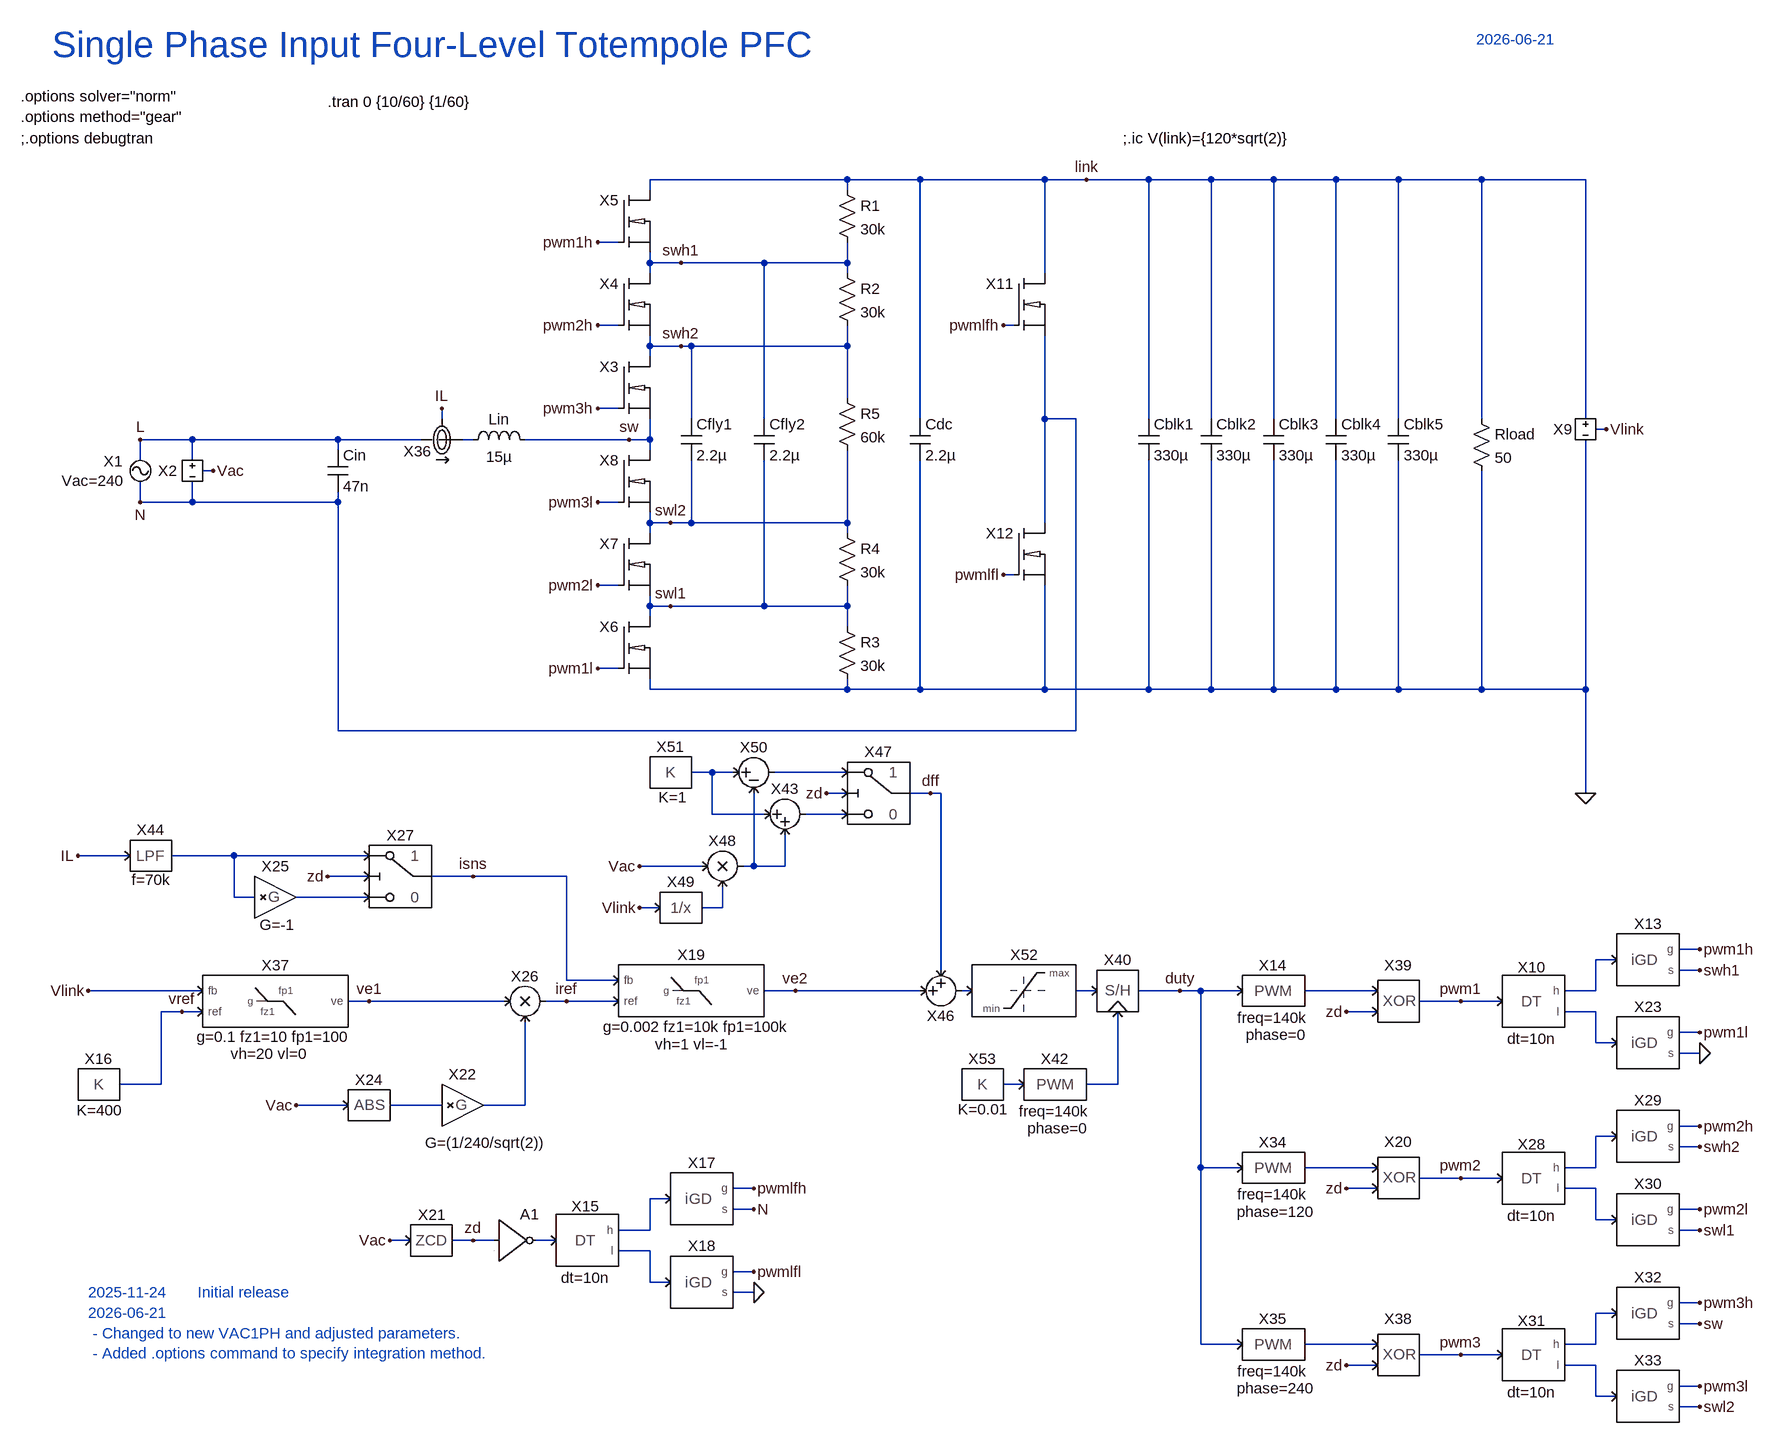
[diagram p0: schematic 1Ph-4LvTTP-PFC.asc]
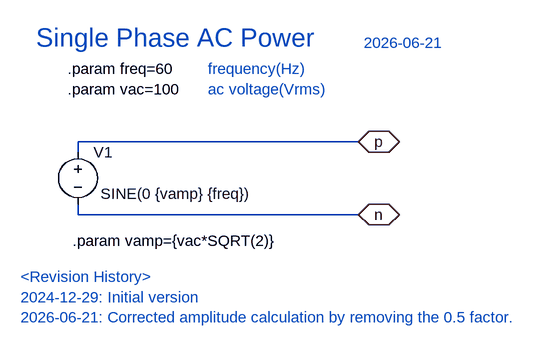
[diagram p1: sub-circuit vac1ph.asc]
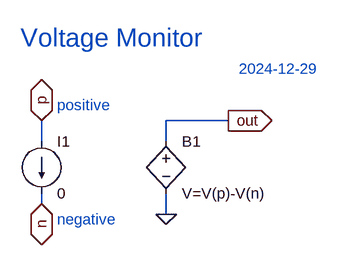
[diagram p2: sub-circuit vmon.asc]
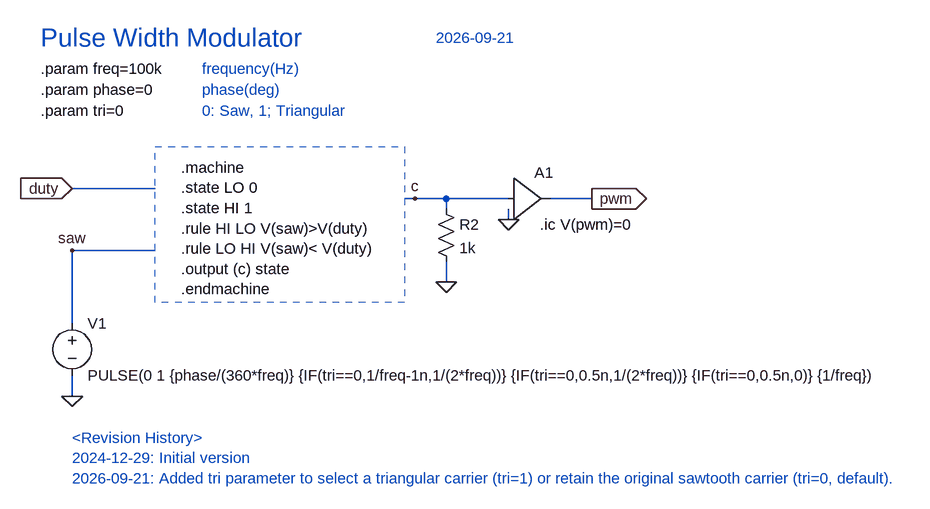
[diagram p3: sub-circuit pwm.asc]
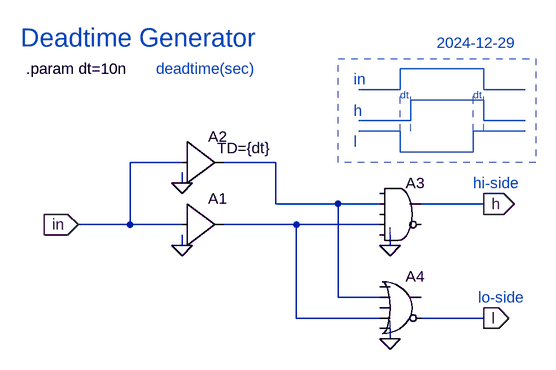
[diagram p4: sub-circuit deadtime.asc]
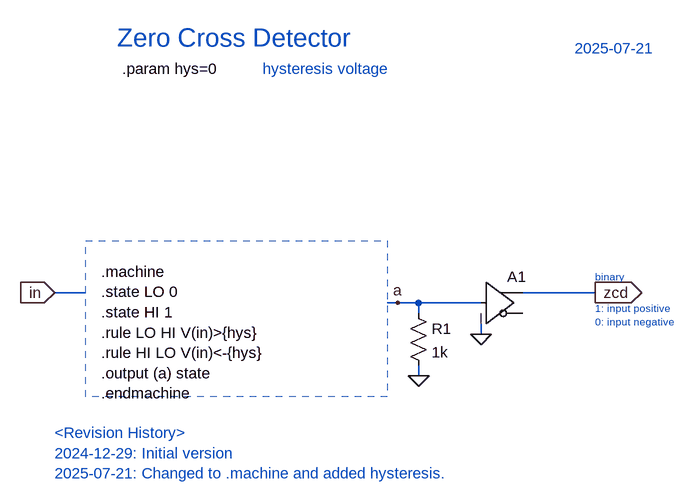
[diagram p5: sub-circuit zcd.asc]
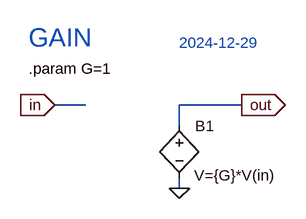
[diagram p6: sub-circuit gain.asc]
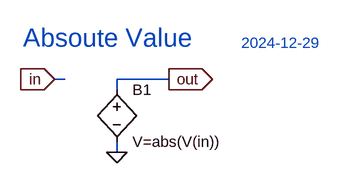
[diagram p7: sub-circuit abs.asc]
1Ph-4LvTTP-PFC.asc, the LTspice schematic file:
Version 4.1
SHEET 1 2440 2172
WIRE 800 -128 496 -128
WIRE 912 -128 800 -128
WIRE 1104 -128 912 -128
WIRE 1168 -128 1104 -128
WIRE 1264 -128 1168 -128
WIRE 1360 -128 1264 -128
WIRE 1456 -128 1360 -128
WIRE 1552 -128 1456 -128
WIRE 1648 -128 1552 -128
WIRE 1776 -128 1648 -128
WIRE 1936 -128 1776 -128
WIRE 496 -112 496 -128
WIRE 800 -112 800 -128
WIRE 448 -32 416 -32
WIRE 496 0 496 -16
WIRE 544 0 496 0
WIRE 672 0 544 0
WIRE 800 0 800 -32
WIRE 800 0 672 0
WIRE 496 16 496 0
WIRE 800 16 800 0
WIRE 1104 16 1104 -128
WIRE 448 96 416 96
WIRE 1056 96 1040 96
WIRE 496 128 496 112
WIRE 544 128 496 128
WIRE 560 128 544 128
WIRE 800 128 800 96
WIRE 800 128 560 128
WIRE 496 144 496 128
WIRE 800 208 800 128
WIRE 448 224 416 224
WIRE 176 240 176 224
WIRE 560 240 560 128
WIRE 672 240 672 0
WIRE 912 240 912 -128
WIRE 1104 240 1104 112
WIRE 1152 240 1104 240
WIRE 1264 240 1264 -128
WIRE 1360 240 1360 -128
WIRE 1456 240 1456 -128
WIRE 1552 240 1552 -128
WIRE 1648 240 1648 -128
WIRE 1776 240 1776 -128
WIRE 1936 240 1936 -128
WIRE 1968 256 1952 256
WIRE -208 272 -288 272
WIRE 16 272 -208 272
WIRE 144 272 16 272
WIRE 224 272 208 272
WIRE 464 272 304 272
WIRE 496 272 496 240
WIRE 496 272 464 272
WIRE 16 288 16 272
WIRE 496 288 496 272
WIRE -288 304 -288 272
WIRE -208 304 -208 272
WIRE -176 320 -192 320
WIRE -288 368 -288 336
WIRE -208 368 -208 336
WIRE -208 368 -288 368
WIRE 16 368 16 352
WIRE 16 368 -208 368
WIRE 448 368 416 368
WIRE 496 400 496 384
WIRE 528 400 496 400
WIRE 560 400 560 304
WIRE 560 400 528 400
WIRE 800 400 800 288
WIRE 800 400 560 400
WIRE 1104 400 1104 240
WIRE 496 416 496 400
WIRE 800 416 800 400
WIRE 1056 480 1040 480
WIRE 448 496 416 496
WIRE 496 528 496 512
WIRE 528 528 496 528
WIRE 672 528 672 304
WIRE 672 528 528 528
WIRE 800 528 800 496
WIRE 800 528 672 528
WIRE 496 544 496 528
WIRE 800 560 800 528
WIRE 448 624 416 624
WIRE 496 656 496 640
WIRE 800 656 800 640
WIRE 800 656 496 656
WIRE 912 656 912 304
WIRE 912 656 800 656
WIRE 1104 656 1104 496
WIRE 1104 656 912 656
WIRE 1264 656 1264 304
WIRE 1264 656 1104 656
WIRE 1360 656 1360 304
WIRE 1360 656 1264 656
WIRE 1456 656 1456 304
WIRE 1456 656 1360 656
WIRE 1552 656 1552 304
WIRE 1552 656 1456 656
WIRE 1648 656 1648 304
WIRE 1648 656 1552 656
WIRE 1776 656 1776 320
WIRE 1776 656 1648 656
WIRE 1936 656 1936 272
WIRE 1936 656 1776 656
WIRE 16 720 16 368
WIRE 1152 720 1152 240
WIRE 1152 720 16 720
WIRE 592 784 560 784
WIRE 624 784 592 784
WIRE 800 784 688 784
WIRE 800 816 768 816
WIRE 928 816 896 816
WIRE 944 816 928 816
WIRE 1936 816 1936 656
WIRE 592 848 592 784
WIRE 672 848 592 848
WIRE 800 848 736 848
WIRE -304 912 -384 912
WIRE -144 912 -240 912
WIRE 64 912 -144 912
WIRE 576 928 480 928
WIRE 656 928 656 816
WIRE 656 928 640 928
WIRE 704 928 704 880
WIRE 704 928 656 928
WIRE 64 944 0 944
WIRE 224 944 160 944
WIRE 368 944 224 944
WIRE -144 976 -144 912
WIRE -112 976 -144 976
WIRE 64 976 -48 976
WIRE 512 992 480 992
WIRE 608 992 608 960
WIRE 608 992 576 992
WIRE 2112 1056 2080 1056
WIRE 1984 1072 1952 1072
WIRE 944 1088 944 816
WIRE 2112 1088 2080 1088
WIRE 368 1104 368 944
WIRE 448 1104 368 1104
WIRE -192 1120 -368 1120
WIRE 720 1120 672 1120
WIRE 912 1120 720 1120
WIRE 992 1120 976 1120
WIRE 1184 1120 1152 1120
WIRE 1312 1120 1248 1120
WIRE 1344 1120 1312 1120
WIRE 1408 1120 1344 1120
WIRE 1616 1120 1504 1120
WIRE 1952 1120 1952 1072
WIRE 1952 1120 1904 1120
WIRE 64 1136 32 1136
WIRE 272 1136 64 1136
WIRE 368 1136 336 1136
WIRE 448 1136 368 1136
WIRE 1744 1136 1680 1136
WIRE 1808 1136 1744 1136
WIRE -224 1152 -256 1152
WIRE -192 1152 -224 1152
WIRE 1616 1152 1568 1152
WIRE 1952 1152 1904 1152
WIRE 2112 1184 2080 1184
WIRE 1952 1200 1952 1152
WIRE 1984 1200 1952 1200
WIRE 2112 1216 2080 1216
WIRE -256 1264 -256 1152
WIRE -256 1264 -320 1264
WIRE 1072 1264 1040 1264
WIRE 1216 1264 1216 1152
WIRE 1216 1264 1168 1264
WIRE 32 1296 -48 1296
WIRE 176 1296 96 1296
WIRE 304 1296 304 1168
WIRE 304 1296 240 1296
WIRE 2112 1328 2080 1328
WIRE 1984 1344 1952 1344
WIRE 2112 1360 2080 1360
WIRE 1344 1392 1344 1120
WIRE 1408 1392 1344 1392
WIRE 1616 1392 1504 1392
WIRE 1952 1392 1952 1344
WIRE 1952 1392 1904 1392
WIRE 1744 1408 1680 1408
WIRE 1808 1408 1744 1408
WIRE 656 1424 624 1424
WIRE 1616 1424 1568 1424
WIRE 1952 1424 1904 1424
WIRE 528 1440 496 1440
WIRE 656 1456 624 1456
WIRE 2112 1456 2080 1456
WIRE 1952 1472 1952 1424
WIRE 1984 1472 1952 1472
WIRE 496 1488 496 1440
WIRE 496 1488 448 1488
WIRE 2112 1488 2080 1488
WIRE 128 1504 96 1504
WIRE 224 1504 192 1504
WIRE 256 1504 224 1504
WIRE 352 1504 320 1504
WIRE 496 1520 448 1520
WIRE 656 1552 624 1552
WIRE 496 1568 496 1520
WIRE 528 1568 496 1568
WIRE 656 1584 624 1584
WIRE 2112 1600 2080 1600
WIRE 1984 1616 1952 1616
WIRE 2112 1632 2080 1632
WIRE 1344 1664 1344 1392
WIRE 1408 1664 1344 1664
WIRE 1616 1664 1504 1664
WIRE 1952 1664 1952 1616
WIRE 1952 1664 1904 1664
WIRE 1744 1680 1680 1680
WIRE 1808 1680 1744 1680
WIRE 1616 1696 1568 1696
WIRE 1952 1696 1904 1696
WIRE 2112 1728 2080 1728
WIRE 1952 1744 1952 1696
WIRE 1984 1744 1952 1744
WIRE 2112 1760 2080 1760
FLAG -176 320 Vac
FLAG 416 -32 pwm1h
FLAG 416 96 pwm2h
FLAG 416 224 pwm3h
FLAG 416 368 pwm3l
FLAG 416 496 pwm2l
FLAG 416 624 pwm1l
FLAG -288 272 L
FLAG -288 368 N
FLAG 176 224 IL
FLAG 1168 -128 link
FLAG 1936 816 0
FLAG 1968 256 Vlink
FLAG -368 1120 Vlink
FLAG -48 1296 Vac
FLAG -384 912 IL
FLAG 656 1424 pwmlfh
FLAG 656 1456 N
FLAG 656 1552 pwmlfl
FLAG 96 1504 Vac
FLAG 368 1136 iref
FLAG 224 944 isns
FLAG 1312 1120 duty
FLAG 224 1504 zd
FLAG 0 944 zd
FLAG 656 1584 0
FLAG 2112 1056 pwm1h
FLAG 2112 1088 swh1
FLAG 2112 1184 pwm1l
FLAG 2112 1216 0
FLAG 2112 1328 pwm2h
FLAG 2112 1360 swh2
FLAG 2112 1456 pwm2l
FLAG 2112 1488 swl1
FLAG 2112 1600 pwm3h
FLAG 2112 1632 sw
FLAG 2112 1728 pwm3l
FLAG 2112 1760 swl2
FLAG 544 0 swh1
FLAG 544 128 swh2
FLAG 528 400 swl2
FLAG 528 528 swl1
FLAG 464 272 sw
FLAG 1568 1152 zd
FLAG 1568 1424 zd
FLAG 1568 1696 zd
FLAG -224 1152 vref
FLAG 1744 1136 pwm1
FLAG 1744 1408 pwm2
FLAG 1744 1680 pwm3
FLAG 928 816 dff
FLAG 480 928 Vac
FLAG 480 992 Vlink
FLAG 1040 96 pwmlfh
FLAG 1040 480 pwmlfl
FLAG 768 816 zd
FLAG 64 1136 ve1
FLAG 720 1120 ve2
SYMBOL VAC1ph -288 320 R0
WINDOW 39 -25 15 Right 2
WINDOW 0 -27 -15 Right 2
SYMATTR SpiceLine Vac=240
SYMATTR InstName X1
SYMBOL VMON -208 320 R0
WINDOW 0 -23 0 Right 2
SYMATTR InstName X2
SYMBOL ind 208 288 R270
WINDOW 0 32 56 VTop 2
WINDOW 3 5 56 VBottom 2
SYMATTR InstName Lin
SYMATTR Value 15µ
SYMATTR SpiceLine Rser=1m
SYMBOL iNMOS 496 192 R0
SYMATTR InstName X3
SYMBOL cap 544 240 R0
SYMATTR InstName Cfly1
SYMATTR Value 2.2µ
SYMATTR SpiceLine Rser=1m
SYMBOL iNMOS 496 64 R0
SYMATTR InstName X4
SYMBOL iNMOS 496 -64 R0
SYMATTR InstName X5
SYMBOL cap 656 240 R0
SYMATTR InstName Cfly2
SYMATTR Value 2.2µ
SYMATTR SpiceLine Rser=1m
SYMBOL iNMOS 496 592 R0
SYMATTR InstName X6
SYMBOL iNMOS 496 464 R0
SYMATTR InstName X7
SYMBOL iNMOS 496 336 R0
SYMATTR InstName X8
SYMBOL cap 896 240 R0
SYMATTR InstName Cdc
SYMATTR Value 2.2µ
SYMATTR SpiceLine Rser=1m
SYMBOL res 1760 224 R0
SYMATTR InstName Rload
SYMATTR Value 50
SYMBOL cap 0 288 R0
SYMATTR InstName Cin
SYMATTR Value 47n
SYMATTR SpiceLine Rser=1m
SYMBOL VMON 1936 256 R0
SYMATTR InstName X9
SYMBOL PWM 1456 1120 R0
WINDOW 39 -56 41 Left 2
WINDOW 0 -1 -55 Top 2
WINDOW 40 4 52 Top 2
SYMATTR SpiceLine freq=140k
SYMATTR InstName X14
SYMBOL DEADTIME 400 1504 R0
WINDOW 0 -3 -68 Top 2
WINDOW 39 -3 42 Top 2
SYMATTR InstName X15
SYMBOL CONST -352 1264 R0
WINDOW 39 1 55 Bottom 2
SYMATTR SpiceLine K=400
SYMATTR InstName X16
SYMBOL iGD 576 1440 R0
SYMATTR InstName X17
SYMBOL iGD 576 1568 R0
SYMATTR InstName X18
SYMBOL ZCD 160 1504 R0
WINDOW 0 1 -24 Bottom 2
SYMATTR InstName X21
SYMBOL GAIN 208 1296 R0
WINDOW 39 36 73 Bottom 2
SYMATTR SpiceLine G=(1/240/sqrt(2))
SYMATTR InstName X22
SYMBOL ABS 64 1296 R0
SYMATTR InstName X24
SYMBOL GAIN -80 976 R0
WINDOW 39 3 58 Bottom 2
SYMATTR SpiceLine G=-1
SYMATTR InstName X25
SYMBOL MUL 304 1136 R0
SYMATTR InstName X26
SYMBOL MUX 112 944 R0
SYMATTR InstName X27
SYMBOL Digital\\inv 256 1440 R0
SYMATTR InstName A1
SYMBOL DEADTIME 1856 1136 R0
WINDOW 0 -3 -68 Top 2
WINDOW 39 -3 42 Top 2
SYMATTR InstName X10
SYMBOL iGD 2032 1072 R0
SYMATTR InstName X13
SYMBOL iGD 2032 1200 R0
SYMATTR InstName X23
SYMBOL DEADTIME 1856 1408 R0
WINDOW 0 -3 -68 Top 2
WINDOW 39 -3 42 Top 2
SYMATTR InstName X28
SYMBOL iGD 2032 1344 R0
SYMATTR InstName X29
SYMBOL iGD 2032 1472 R0
SYMATTR InstName X30
SYMBOL DEADTIME 1856 1680 R0
WINDOW 0 -3 -68 Top 2
WINDOW 39 -3 42 Top 2
SYMATTR InstName X31
SYMBOL iGD 2032 1616 R0
SYMATTR InstName X32
SYMBOL iGD 2032 1744 R0
SYMATTR InstName X33
SYMBOL PWM 1456 1392 R0
WINDOW 39 -56 41 Left 2
WINDOW 0 -1 -55 Top 2
WINDOW 40 4 52 Top 2
SYMATTR SpiceLine freq=140k
SYMATTR InstName X34
SYMATTR SpiceLine2 phase=120
SYMBOL PWM 1456 1664 R0
WINDOW 39 -56 41 Left 2
WINDOW 0 -1 -55 Top 2
WINDOW 40 4 52 Top 2
SYMATTR SpiceLine freq=140k
SYMATTR InstName X35
SYMATTR SpiceLine2 phase=240
SYMBOL IMON 176 272 M180
SYMATTR InstName X36
SYMBOL TYPE2_gm -80 1136 R0
WINDOW 39 -3 70 Bottom 2
WINDOW 40 -10 96 Bottom 2
SYMATTR SpiceLine g=0.1 fz1=10 fp1=100
SYMATTR SpiceLine2 vh=20 vl=0
SYMATTR InstName X37
SYMBOL TYPE2_gm 560 1120 R0
WINDOW 39 8 71 Bottom 2
WINDOW 40 1 98 Bottom 2
WINDOW 123 4 -101 Bottom 2
SYMATTR SpiceLine g=0.002 fz1=10k fp1=100k
SYMATTR SpiceLine2 vh=1 vl=-1
SYMATTR InstName X19
SYMBOL EXOR 1648 1136 R0
WINDOW 0 0 -40 Bottom 2
SYMATTR InstName X39
SYMBOL EXOR 1648 1408 R0
WINDOW 0 0 -40 Bottom 2
SYMATTR InstName X20
SYMBOL EXOR 1648 1680 R0
WINDOW 0 0 -40 Bottom 2
SYMATTR InstName X38
SYMBOL cap 1248 240 R0
SYMATTR Value 330µ
SYMATTR InstName Cblk1
SYMATTR SpiceLine V=450 Irms=1.45 Rser=0.104 Lser=24.231n mfg="W・th Elektronik" pn="861141486022 WCAP-AI3H 35x40" type="Al electrolytic"
SYMBOL cap 1344 240 R0
SYMATTR Value 330µ
SYMATTR InstName Cblk2
SYMATTR SpiceLine V=450 Irms=1.45 Rser=0.104 Lser=24.231n mfg="W・th Elektronik" pn="861141486022 WCAP-AI3H 35x40" type="Al electrolytic"
SYMBOL cap 1440 240 R0
SYMATTR Value 330µ
SYMATTR InstName Cblk3
SYMATTR SpiceLine V=450 Irms=1.45 Rser=0.104 Lser=24.231n mfg="W・th Elektronik" pn="861141486022 WCAP-AI3H 35x40" type="Al electrolytic"
SYMBOL cap 1536 240 R0
SYMATTR Value 330µ
SYMATTR InstName Cblk4
SYMATTR SpiceLine V=450 Irms=1.45 Rser=0.104 Lser=24.231n mfg="W・th Elektronik" pn="861141486022 WCAP-AI3H 35x40" type="Al electrolytic"
SYMBOL cap 1632 240 R0
SYMATTR Value 330µ
SYMATTR InstName Cblk5
SYMATTR SpiceLine V=450 Irms=1.45 Rser=0.104 Lser=24.231n mfg="W・th Elektronik" pn="861141486022 WCAP-AI3H 35x40" type="Al electrolytic"
SYMBOL PWM 1120 1264 R0
WINDOW 39 -56 41 Left 2
WINDOW 0 -1 -55 Top 2
WINDOW 40 4 52 Top 2
SYMATTR SpiceLine freq=140k
SYMATTR InstName X42
SYMBOL LPF -272 912 R0
WINDOW 3 1 53 Bottom 2
SYMATTR Value f=70k
SYMATTR InstName X44
SYMBOL SAMPLEHOLD 1216 1120 R0
SYMATTR InstName X40
SYMBOL SUM 944 1120 M180
SYMATTR InstName X46
SYMBOL MUX 848 816 R0
SYMATTR InstName X47
SYMBOL MUL 608 928 R0
SYMATTR InstName X48
SYMBOL INVERSE 544 992 R0
SYMATTR InstName X49
SYMBOL SUB 656 784 R0
SYMATTR InstName X50
SYMBOL CONST 528 784 R0
WINDOW 39 3 54 Bottom 2
SYMATTR InstName X51
SYMBOL LIMIT 1072 1120 R0
SYMATTR InstName X52
SYMBOL iNMOS 1104 64 R0
SYMATTR InstName X11
SYMBOL iNMOS 1104 448 R0
SYMATTR InstName X12
SYMBOL CONST 1008 1264 R0
WINDOW 39 1 54 Bottom 2
SYMATTR SpiceLine K=0.01
SYMATTR InstName X53
SYMBOL res 784 -128 R0
SYMATTR InstName R1
SYMATTR Value 30k
SYMBOL res 784 0 R0
SYMATTR InstName R2
SYMATTR Value 30k
SYMBOL res 784 544 R0
SYMATTR InstName R3
SYMATTR Value 30k
SYMBOL res 784 400 R0
SYMATTR InstName R4
SYMATTR Value 30k
SYMBOL res 784 192 R0
SYMATTR InstName R5
SYMATTR Value 60k
SYMBOL SUM 704 848 R0
SYMATTR InstName X43
TEXT -424 -336 Left 5 ;Single Phase Input Four-Level Totempole PFC
TEXT 1768 -344 Left 2 ;2026-06-21
TEXT 0 -248 Left 2 !.tran 0 {10/60} {1/60}
TEXT -472 -256 Left 2 !.options solver="norm"\n.options method="gear"
TEXT -472 -192 Left 2 !;.options debugtran
TEXT 1224 -192 Left 2 !;.ic V(link)={120*sqrt(2)}
TEXT -368 1584 Left 2 ;2025-11-24       Initial release\n2026-06-21       \n - Changed to new VAC1PH and adjusted parameters.\n - Added .options command to specify integration method.

vac1ph.asc, the sub-circuit schematic file:
Version 4.1
SHEET 1 1308 680
WIRE 496 112 64 112
WIRE 64 128 64 112
WIRE 64 224 64 208
WIRE 496 224 64 224
FLAG 496 112 p
IOPIN 496 112 BiDir
FLAG 496 224 n
IOPIN 496 224 BiDir
SYMBOL voltage 64 112 R0
WINDOW 3 35 80 Left 2
WINDOW 123 0 0 Left 0
WINDOW 39 0 0 Left 0
SYMATTR Value SINE(0 {vamp} {freq})
SYMATTR InstName V1
TEXT 48 0 Left 2 !.param freq=60\n.param vac=100
TEXT 0 -48 Left 4 ;Single Phase AC Power
TEXT 264 0 Left 2 ;frequency(Hz)\nac voltage(Vrms)
TEXT 56 264 Left 2 !.param vamp={vac*SQRT(2)}
TEXT 504 -40 Left 2 ;2026-06-21
TEXT -24 320 Left 2 ;<Revision History>\n2024-12-29: Initial version\n2026-06-21: Corrected amplitude calculation by removing the 0.5 factor.

vmon.asc, the sub-circuit schematic file:
Version 4
SHEET 1 880 680
WIRE 176 -32 80 -32
WIRE -112 0 -112 -32
WIRE 80 0 80 -32
WIRE -112 96 -112 80
WIRE 80 112 80 80
FLAG -112 -32 p
IOPIN -112 -32 BiDir
FLAG -112 96 n
IOPIN -112 96 BiDir
FLAG 176 -32 out
IOPIN 176 -32 Out
FLAG 80 112 0
SYMBOL bv 80 -16 R0
SYMATTR InstName B1
SYMATTR Value V=V(p)-V(n)
SYMBOL current -112 0 R0
WINDOW 123 0 0 Left 0
WINDOW 39 0 0 Left 0
SYMATTR InstName I1
SYMATTR Value 0
TEXT -144 -160 Left 4 ;Voltage Monitor
TEXT -88 -56 Left 2 ;positive
TEXT -88 120 Left 2 ;negative
TEXT 192 -112 Left 2 ;2024-12-29

pwm.asc, the sub-circuit schematic file:
Version 4.1
SHEET 1 1668 1312
WIRE 32 64 -96 64
WIRE 432 80 416 80
WIRE 480 80 432 80
WIRE 576 80 480 80
WIRE 704 80 640 80
WIRE 480 96 480 80
WIRE 576 112 576 96
WIRE 32 160 -96 160
WIRE 480 208 480 176
WIRE -96 272 -96 160
WIRE -96 384 -96 352
FLAG -96 64 duty
IOPIN -96 64 In
FLAG 704 80 pwm
IOPIN 704 80 Out
FLAG 480 208 0
FLAG 432 80 c
FLAG 576 112 0
FLAG -96 384 0
FLAG -96 160 saw
SYMBOL res 464 80 R0
SYMATTR InstName R2
SYMATTR Value 1k
SYMBOL Digital\\buf1 576 16 R0
SYMATTR InstName A1
SYMBOL voltage -96 256 R0
WINDOW 123 0 0 Left 0
WINDOW 39 0 0 Left 0
SYMATTR InstName V1
SYMATTR Value PULSE(0 1 {phase/(360*freq)} {IF(tri==0,1/freq-1n,1/(2*freq))} {IF(tri==0,0.5n,1/(2*freq))} {IF(tri==0,0.5n,0)} {1/freq})
TEXT 72 32 Left 2 !.machine\n.state LO 0\n.state HI 1\n.rule HI LO V(saw)>V(duty)\n.rule LO HI V(saw)< V(duty)\n.output (c) state\n.endmachine
TEXT -144 -120 Left 2 !.param freq=100k
TEXT 624 120 Left 2 !.ic V(pwm)=0
TEXT -144 -88 Left 2 !.param phase=0
TEXT -144 -168 Left 4 ;Pulse Width Modulator
TEXT 464 -168 Left 2 ;2026-09-21
TEXT 104 -120 Left 2 ;frequency(Hz)
TEXT -144 -56 Left 2 !.param tri=0
TEXT 104 -56 Left 2 ;0: Saw, 1; Triangular
TEXT 104 -88 Left 2 ;phase(deg)
TEXT -96 448 Left 2 ;<Revision History>\n2024-12-29: Initial version\n2026-09-21: Added tri parameter to select a triangular carrier (tri=1) or retain the original sawtooth carrier (tri=0, default).
RECTANGLE Normal 416 240 32 0 2

deadtime.asc, the sub-circuit schematic file:
Version 4
SHEET 1 1412 1312
WIRE 64 288 -16 288
WIRE 208 288 128 288
WIRE 64 320 64 304
WIRE 208 352 208 288
WIRE 304 352 208 352
WIRE 368 352 304 352
WIRE 528 352 432 352
WIRE -16 384 -16 288
WIRE -16 384 -96 384
WIRE 64 384 -16 384
WIRE 240 384 128 384
WIRE 368 384 240 384
WIRE 64 416 64 400
WIRE 384 416 384 400
WIRE 304 496 304 352
WIRE 368 496 304 496
WIRE 240 528 240 384
WIRE 368 528 240 528
WIRE 528 528 432 528
WIRE 384 560 384 544
FLAG -96 384 in
IOPIN -96 384 In
FLAG 64 416 0
FLAG 64 320 0
FLAG 384 416 0
FLAG 384 560 0
FLAG 528 352 h
IOPIN 528 352 Out
FLAG 528 528 l
IOPIN 528 528 Out
SYMBOL Digital\\buf1 64 320 R0
SYMATTR InstName A1
SYMBOL Digital\\buf1 64 224 R0
WINDOW 3 54 42 Left 2
SYMATTR Value TD={dt}
SYMATTR InstName A2
SYMBOL Digital\\and 400 304 R0
SYMATTR InstName A3
SYMBOL Digital\\or 400 448 R0
SYMATTR InstName A4
TEXT -176 144 Left 2 !.param dt=10n
TEXT -184 96 Left 4 ;Deadtime Generator
TEXT 24 144 Left 2 ;deadtime(sec)
TEXT 512 320 Left 2 ;hi-side
TEXT 520 496 Left 2 ;lo-side
TEXT 328 160 Left 2 ;in
TEXT 328 208 Left 2 ;h
TEXT 328 256 Left 2 ;l
TEXT 400 184 Left 1 ;dt
TEXT 512 184 Left 1 ;dt
TEXT 456 104 Left 2 ;2024-12-29
LINE Normal 400 176 336 176
LINE Normal 400 176 400 144
LINE Normal 528 144 400 144
LINE Normal 528 176 528 144
LINE Normal 592 176 528 176
LINE Normal 416 224 336 224
LINE Normal 416 224 416 192
LINE Normal 528 192 416 192
LINE Normal 528 224 528 192
LINE Normal 592 224 528 224
LINE Normal 400 240 336 240
LINE Normal 400 272 400 240
LINE Normal 512 272 400 272
LINE Normal 512 272 512 240
LINE Normal 592 240 512 240
LINE Normal 400 240 400 176 2
LINE Normal 512 240 512 176 2
LINE Normal 416 240 416 176 2
LINE Normal 528 240 528 176 2
RECTANGLE Normal 608 288 304 128 2

zcd.asc, the sub-circuit schematic file:
Version 4.1
SHEET 1 952 680
WIRE -32 384 -80 384
WIRE 752 384 640 384
WIRE 448 400 432 400
WIRE 480 400 448 400
WIRE 576 400 480 400
WIRE 480 416 480 400
WIRE 576 448 576 432
WIRE 480 512 480 496
FLAG -80 384 in
IOPIN -80 384 In
FLAG 752 384 zcd
IOPIN 752 384 Out
FLAG 480 512 0
FLAG 448 400 a
FLAG 576 448 0
SYMBOL res 464 400 R0
SYMATTR InstName R1
SYMATTR Value 1k
SYMBOL Digital\\buf 576 336 R0
SYMATTR InstName A1
TEXT 16 -8 Left 4 ;Zero Cross Detector
TEXT 752 360 Left 1 ;binary
TEXT 752 408 Left 1 ;1: input positive\n0: input negative
TEXT 720 8 Left 2 ;2025-07-21
TEXT -8 352 Left 2 !.machine\n.state LO 0\n.state HI 1\n.rule LO HI V(in)>{hys}\n.rule HI LO V(in)<-{hys}\n.output (a) state\n.endmachine
TEXT 24 40 Left 2 !.param hys=0
TEXT 240 40 Left 2 ;hysteresis voltage
TEXT -80 600 Left 2 ;<Revision History>\n2024-12-29: Initial version\n2025-07-21: Changed to .machine and added hysteresis.
RECTANGLE Normal 432 544 -32 304 2

gain.asc, the sub-circuit schematic file:
Version 4
SHEET 1 880 680
WIRE 0 64 -48 64
WIRE 240 64 144 64
WIRE 144 96 144 64
WIRE 144 192 144 176
FLAG 144 192 0
FLAG 240 64 out
IOPIN 240 64 Out
FLAG -48 64 in
IOPIN -48 64 In
SYMBOL bv 144 80 R0
WINDOW 3 23 92 Left 2
SYMATTR Value V={G}*V(in)
SYMATTR InstName B1
TEXT -88 8 Left 2 !.param G=1
TEXT -88 -40 Left 4 ;GAIN
TEXT 144 -32 Left 2 ;2024-12-29

abs.asc, the sub-circuit schematic file:
Version 4
SHEET 1 880 680
WIRE 80 128 64 128
WIRE 240 128 160 128
WIRE 160 144 160 128
WIRE 160 240 160 224
FLAG 64 128 in
IOPIN 64 128 In
FLAG 160 240 0
FLAG 240 128 out
IOPIN 240 128 Out
SYMBOL bv 160 128 R0
SYMATTR InstName B1
SYMATTR Value V=abs(V(in))
TEXT 16 64 Left 4 ;Absoute Value
TEXT 352 72 Left 2 ;2024-12-29

mul.asc, the sub-circuit schematic file:
Version 4
SHEET 1 880 680
WIRE 96 48 48 48
WIRE 320 48 240 48
WIRE 96 64 96 48
WIRE 240 64 240 48
WIRE 96 160 96 144
WIRE 240 160 240 144
WIRE 96 208 48 208
WIRE 96 224 96 208
WIRE 96 320 96 304
FLAG 48 48 IN1
IOPIN 48 48 In
FLAG 48 208 IN2
IOPIN 48 208 In
FLAG 240 160 0
FLAG 320 48 OUT
IOPIN 320 48 Out
FLAG 96 160 0
FLAG 96 320 0
SYMBOL bv 240 48 R0
SYMATTR InstName B1
SYMATTR Value V=V(IN1)*V(IN2)
SYMBOL res 80 48 R0
SYMATTR InstName R1
SYMATTR Value 1Meg
SYMBOL res 80 208 R0
SYMATTR InstName R2
SYMATTR Value 1Meg
TEXT -16 -56 Left 4 ;Multiplier

mux.asc, the sub-circuit schematic file:
Version 4
SHEET 1 880 680
WIRE 336 16 208 16
WIRE 128 32 96 32
WIRE 208 48 208 16
WIRE 128 80 96 80
WIRE 128 144 96 144
WIRE 208 160 208 128
FLAG 96 32 in1
IOPIN 96 32 In
FLAG 96 80 in2
IOPIN 96 80 In
FLAG 96 144 sel
IOPIN 96 144 In
FLAG 336 16 out
IOPIN 336 16 Out
FLAG 208 160 0
SYMBOL bv 208 32 R0
SYMATTR InstName B1
SYMATTR Value V=IF(V(sel)>0.5,V(in1),V(in2))
TEXT 24 -40 Left 2 ;2-1 Multiplexer
TEXT 40 120 Left 1 ;binary
TEXT 40 168 Left 1 ;1: out=in1\n0: out=in2

type2_gm.asc, the sub-circuit schematic file:
Version 4.1
SHEET 1 1136 680
WIRE 432 -144 432 -160
WIRE 544 -144 544 -160
WIRE 432 -48 432 -64
WIRE 544 -48 544 -64
WIRE -128 144 -128 112
WIRE 416 144 416 96
WIRE -336 176 -368 176
WIRE -336 256 -368 256
WIRE -128 272 -128 224
WIRE -128 272 -240 272
WIRE 0 272 -128 272
WIRE 416 272 416 208
WIRE 416 272 0 272
WIRE 640 272 416 272
WIRE -128 304 -128 272
WIRE -240 336 -240 272
WIRE 0 336 0 272
WIRE 416 352 416 272
WIRE -128 416 -128 384
WIRE 416 448 416 416
WIRE -240 496 -240 416
WIRE -128 496 -128 480
WIRE 0 496 0 400
FLAG 640 272 ve
IOPIN 640 272 Out
FLAG -128 496 0
FLAG -240 496 0
FLAG 0 496 0
FLAG -128 112 0
FLAG 544 -48 0
FLAG 432 -48 0
FLAG 432 -160 +V
FLAG 544 -160 -V
FLAG 416 448 -V
FLAG 416 96 +V
FLAG -368 176 fb
IOPIN -368 176 In
FLAG -368 256 ref
IOPIN -368 256 In
SYMBOL bi -128 144 R0
SYMATTR InstName B1
SYMATTR Value I=(limit(V(ref)-V(fb),{-Ilim},{Ilim}))
SYMBOL res -144 288 R0
SYMATTR InstName R1
SYMATTR Value {Rz1}
SYMBOL cap -144 416 R0
SYMATTR InstName C1
SYMATTR Value {Cz1}
SYMBOL res -256 320 R0
SYMATTR InstName R2
SYMATTR Value {avol}
SYMBOL cap -16 336 R0
SYMATTR InstName C2
SYMATTR Value {Co1}
SYMBOL diode 432 416 R180
WINDOW 0 24 64 Left 2
WINDOW 3 24 0 Left 2
SYMATTR InstName D1
SYMATTR Value myD
SYMBOL voltage 432 -160 R0
SYMATTR InstName V1
SYMATTR Value {vh}
SYMBOL voltage 544 -160 R0
WINDOW 123 0 0 Left 0
WINDOW 39 24 44 Left 2
SYMATTR InstName V2
SYMATTR Value {vl}
SYMBOL diode 432 208 R180
WINDOW 0 24 64 Left 2
WINDOW 3 24 0 Left 2
SYMATTR InstName D2
SYMATTR Value myD
TEXT -336 -224 Left 2 !.param g=1\n.param fz1=1k\n.param fp1=20k\n.param vh=5\n.param vl=0\n.param avol=100k
TEXT -352 -288 Left 4 ;Type 2 Compensator, Gm amp base
TEXT -104 -224 Left 2 ;target gain at fz1\nzero frequency(Hz)\npole frequency(Hz)\nmax ouput voltage(V)\nmin output voltage(V)\nopen loop gain
TEXT 808 -328 Left 2 ;2025-08-31
TEXT -56 24 Left 2 !.param Rz1={(g*avol)/(avol-g)}\n.param Cz1={1/(2*PI*fz1*Rz1)}\n.param Co1={1/(2*PI*fp1*Rz1)}
TEXT 488 312 Left 2 !.ic V(ve)=0
TEXT 480 440 Left 2 !.MODEL myD D(RON=1u ROFF=1G Vfwd=10n)
TEXT -88 184 Left 2 !.param Ilim=1000
TEXT 672 -184 Left 2 ;<Revision History>\n2025-08-31: Initial version
TEXT -416 144 Left 2 ;feedback
TEXT -416 216 Left 2 ;reference
TEXT 384 -288 Left 1 ;* TYPE2_gm is a Gm-amp based version of TYPE2.\n* Unlike the op-amp based TYPE2, it offers high input impedance at ref/fb\n* and is better suited for dynamic reference applications (e.g. soft-start,\n* motor speed control). Both models are kept for flexibility.
RECTANGLE Normal 992 -208 368 -304 2

exor.asc, the sub-circuit schematic file:
Version 4
SHEET 1 880 680
WIRE 160 128 32 128
WIRE 368 128 224 128
WIRE 160 160 32 160
WIRE 192 192 192 176
FLAG 192 192 0
FLAG 32 128 in1
IOPIN 32 128 In
FLAG 32 160 in2
IOPIN 32 160 In
FLAG 368 128 out
IOPIN 368 128 Out
SYMBOL Digital\\xor 208 80 R0
WINDOW 0 -28 14 Left 2
SYMATTR InstName A1
TEXT -24 104 Left 1 ;binary
TEXT -24 184 Left 1 ;binary
TEXT 368 104 Left 1 ;binary
TEXT -32 40 Left 4 ;Exclusive OR
TEXT 280 48 Left 2 ;2024-12-29

lpf.asc, the sub-circuit schematic file:
Version 4.1
SHEET 1 1652 804
WIRE 944 -80 848 -80
WIRE 192 -48 80 -48
WIRE 304 -48 272 -48
WIRE 384 -48 304 -48
WIRE 688 -48 464 -48
WIRE 80 -32 80 -48
WIRE 304 -32 304 -48
WIRE 464 -32 464 -48
WIRE 848 -16 848 -80
WIRE -96 0 -160 0
WIRE 304 48 304 32
WIRE 464 64 464 48
WIRE 80 80 80 48
WIRE 848 112 848 64
WIRE 192 288 192 256
WIRE 192 288 128 288
WIRE 256 288 192 288
WIRE 496 288 496 256
WIRE 496 288 432 288
WIRE 560 288 496 288
WIRE 192 320 192 288
WIRE 256 320 256 288
WIRE 432 320 432 288
WIRE 496 320 496 288
WIRE 560 320 560 288
WIRE 128 336 128 288
WIRE 128 480 128 416
WIRE 192 480 192 384
WIRE 256 480 256 400
WIRE 432 480 432 400
WIRE 496 480 496 384
WIRE 560 480 560 400
FLAG -160 0 in
IOPIN -160 0 In
FLAG 944 -80 out
IOPIN 944 -80 Out
FLAG 304 48 0
FLAG 80 80 0
FLAG 384 -48 a
FLAG 464 64 0
FLAG 848 112 0
FLAG 256 480 0
FLAG 192 256 v1
FLAG 496 256 v2
FLAG 128 480 0
FLAG 560 480 0
FLAG 688 -48 v0
FLAG 192 480 0
FLAG 496 480 0
FLAG 432 480 0
SYMBOL res 288 -64 R90
WINDOW 0 0 56 VBottom 2
WINDOW 3 32 56 VTop 2
SYMATTR InstName R1
SYMATTR Value 1k
SYMBOL cap 288 -32 R0
SYMATTR InstName C1
SYMATTR Value {Co}
SYMBOL bv 80 -48 R0
SYMATTR InstName B1
SYMATTR Value V=V(in)
SYMBOL bv 464 -48 R0
SYMATTR InstName B2
SYMATTR Value V=V(a)
SYMBOL bv 848 -32 R0
SYMATTR InstName B3
SYMATTR Value V=IF({n}==1,V(v0),V(v1))
SYMBOL res 240 304 R0
SYMATTR InstName R2
SYMATTR Value 1Gig
SYMBOL cap 176 320 R0
SYMATTR InstName C2
SYMATTR Value 1
SYMBOL bi 128 416 R180
WINDOW 0 24 80 Left 2
WINDOW 3 24 0 Left 2
SYMATTR InstName B5
SYMATTR Value I=V(v2)
SYMBOL res 448 304 M0
SYMATTR InstName R3
SYMATTR Value 1Gig
SYMBOL cap 512 320 M0
SYMATTR InstName C3
SYMATTR Value 1
SYMBOL bi 560 400 R180
WINDOW 3 -848 -5 Left 2
WINDOW 0 -56 82 Left 2
SYMATTR Value I={-(2*pi*f)*(2*pi*f)*V(v1)-(2*pi*f/q)*V(v2)+(2*pi*f)*(2*pi*f)*V(in)}
SYMATTR InstName B4
TEXT -264 -368 Left 4 ;1st/2nd order Low Pass Filter
TEXT 696 -368 Left 2 ;2025-12-26
TEXT -256 -304 Left 2 !.param f=100k\n.param n=1\n.param q=0.5
TEXT 328 -80 Left 2 !.param Co=1/({f}*2k*PI)
TEXT 0 -304 Left 2 ;cut off frequency\nfilter order (1:1st order, other: 2nd order)\nq factor (only for 2nd order)
TEXT -8 -112 Left 2 ;1st Order LPF
TEXT 8 160 Left 2 ;2nd Order LPF
TEXT -152 560 Left 2 ;<Revision History>\n2025-03-23: Initial version\n2025-12-26: \n -  Replaced LTspice built in 2ndOrderLPF with discrete circuit to improve convergence.\n -  Removed output MUX and replaced it with BV.
RECTANGLE Normal 752 112 -16 -96 2
RECTANGLE Normal 1440 512 -16 192 2

samplehold.asc, the sub-circuit schematic file:
Version 4
SHEET 1 880 680
WIRE 576 -560 480 -560
WIRE -80 -512 -128 -512
WIRE 480 -512 480 -560
WIRE 368 -496 368 -528
WIRE -80 -448 -128 -448
WIRE 368 -400 368 -416
WIRE 480 -400 480 -432
FLAG -128 -512 IN
IOPIN -128 -512 In
FLAG -128 -448 CLK
IOPIN -128 -448 In
FLAG 576 -560 OUT
IOPIN 576 -560 Out
FLAG 368 -400 0
FLAG 368 -528 o
FLAG 480 -400 0
SYMBOL res 352 -512 R0
SYMATTR InstName R1
SYMATTR Value 1k
SYMBOL bv 480 -528 R0
SYMATTR InstName B1
SYMATTR Value V=V(o)
TEXT -248 -672 Left 3 ;Sample & Hold
TEXT -248 -448 Left 1 ;binary
TEXT 496 -656 Left 2 ;2025-3-23
TEXT -24 -544 Left 2 !.machine\n.state LO 0\n.state LATCH 1\n.state HI 2\n.rule LO LATCH V(clk)>.5\n.rule LATCH HI  V(clk)>.9\n.rule * LO V(clk)<.5\n.output (o) IF((state==1),V(in),V(out))  \n.endmachine

sum.asc, the sub-circuit schematic file:
Version 4
SHEET 1 880 680
WIRE 288 96 208 96
WIRE 208 112 208 96
WIRE 96 128 48 128
WIRE 96 176 48 176
WIRE 208 208 208 192
FLAG 48 128 IN1
IOPIN 48 128 In
FLAG 48 176 IN2
IOPIN 48 176 In
FLAG 208 208 0
FLAG 288 96 OUT
IOPIN 288 96 Out
SYMBOL bv 208 96 R0
SYMATTR InstName B1
SYMATTR Value V=V(IN1)+V(IN2)
TEXT -16 32 Left 4 ;SUM
TEXT 200 40 Left 2 ;2024-12-29

inverse.asc, the sub-circuit schematic file:
Version 4
SHEET 1 1360 680
WIRE 672 144 192 144
WIRE 1264 144 672 144
WIRE 672 160 672 144
WIRE 192 176 192 144
WIRE 80 208 32 208
WIRE 672 240 672 224
WIRE 192 288 192 256
FLAG 32 208 in
IOPIN 32 208 In
FLAG 192 288 0
FLAG 1264 144 out
IOPIN 1264 144 Out
FLAG 672 240 0
SYMBOL bv 192 160 R0
WINDOW 3 37 125 Left 2
SYMATTR Value V=IF(V(in)>0,IF(V(in)>(1/{vsat}),1/V(in),{vsat}),IF(V(in)>(-1/{vsat}),-{vsat},1/V(in)))
SYMATTR InstName B1
SYMBOL cap 656 160 R0
SYMATTR InstName C1
SYMATTR Value 10p
SYMATTR SpiceLine Rser=1k
TEXT -32 16 Left 4 ;Inverse
TEXT 1168 8 Left 2 ;2025-2-23
TEXT -24 64 Left 2 !.param vsat=1k
TEXT 224 64 Left 2 ;saturation voltage
TEXT 120 400 Left 2 ;<Revision History>\n2025-01-03: Initial Versoin.\n2025-02-23: Added RC snubber(10pF-1kohm) at output to reduce spike

sub.asc, the sub-circuit schematic file:
Version 4
SHEET 1 880 680
WIRE 288 96 208 96
WIRE 208 112 208 96
WIRE 96 128 48 128
WIRE 96 176 48 176
WIRE 208 208 208 192
FLAG 48 128 IN1
IOPIN 48 128 In
FLAG 48 176 IN2
IOPIN 48 176 In
FLAG 208 208 0
FLAG 288 96 OUT
IOPIN 288 96 Out
SYMBOL bv 208 96 R0
SYMATTR InstName B1
SYMATTR Value V=V(IN1)-V(IN2)
TEXT -16 40 Left 2 ;SUBTRACT
TEXT 224 48 Left 2 ;2024-12-29

The netlist it stands for:
* 1Ph-4LvTTP-PFC.asc
X§X1 N L vac1ph params: Vac=240 freq=60
X§X2 N Vac L vmon
Lin N001 sw 15µ Rser=1m
X§X3 swh2 pwm3h sw iNMOS params: esl=1f rsnb=1k csnb=10p ron=10m  ; pins D G S
Cfly1 swh2 swl2 2.2µ Rser=1m
X§X4 swh1 pwm2h swh2 iNMOS params: esl=1f rsnb=1k csnb=10p ron=10m  ; pins D G S
X§X5 link pwm1h swh1 iNMOS params: esl=1f rsnb=1k csnb=10p ron=10m  ; pins D G S
Cfly2 swh1 swl1 2.2µ Rser=1m
X§X6 swl1 pwm1l 0 iNMOS params: esl=1f rsnb=1k csnb=10p ron=10m  ; pins D G S
X§X7 swl2 pwm2l swl1 iNMOS params: esl=1f rsnb=1k csnb=10p ron=10m  ; pins D G S
X§X8 sw pwm3l swl2 iNMOS params: esl=1f rsnb=1k csnb=10p ron=10m  ; pins D G S
Cdc link 0 2.2µ Rser=1m
Rload link 0 50
Cin L N 47n Rser=1m
X§X9 0 Vlink link vmon
X§X14 duty N012 pwm params: tri=0 freq=140k phase=0
X§X15 N022 N023 N021 deadtime params: dt=10n
X§X16 vref CONST K=400  ; pins K
X§X17 N021 pwmlfh N iGD  ; pins in g s
X§X18 N023 pwmlfl 0 iGD  ; pins in g s
X§X21 Vac zd zcd params: hys=0
X§X22 N016 N017 gain params: G=(1/240/sqrt(2))
X§X24 Vac N016 abs
X§X25 N005 N007 gain params: G=-1
X§X26 ve1 N017 iref mul
X§X27 N005 N007 zd isns mux
A1 zd 0 0 0 0 N022 0 0 BUF
X§X10 pwm1 N013 N009 deadtime params: dt=10n
X§X13 N009 pwm1h swh1 iGD  ; pins in g s
X§X23 N013 pwm1l 0 iGD  ; pins in g s
X§X28 pwm2 N020 N018 deadtime params: dt=10n
X§X29 N018 pwm2h swh2 iGD  ; pins in g s
X§X30 N020 pwm2l swl1 iGD  ; pins in g s
X§X31 pwm3 N026 N024 deadtime params: dt=10n
X§X32 N024 pwm3h sw iGD  ; pins in g s
X§X33 N026 pwm3l swl2 iGD  ; pins in g s
X§X34 duty N019 pwm params: tri=0 freq=140k phase=120
X§X35 duty N025 pwm params: tri=0 freq=140k phase=240
X§X36 N001 IL L IMON rsns=10u  ; pins n out p
X§X37 Vlink vref ve1 type2_gm params: avol=100k g=0.1 fz1=10 fp1=100 vh=20 vl=0
X§X19 isns iref ve2 type2_gm params: avol=100k g=0.002 fz1=10k fp1=100k vh=1 vl=-1
X§X39 N012 zd pwm1 exor
X§X20 N019 zd pwm2 exor
X§X38 N025 zd pwm3 exor
Cblk1 link 0 330µ V=450 Irms=1.45 Rser=0.104 Lser=24.231n mfg="W・th Elektronik" pn="861141486022 WCAP-AI3H 35x40" type="Al electrolytic"
Cblk2 link 0 330µ V=450 Irms=1.45 Rser=0.104 Lser=24.231n mfg="W・th Elektronik" pn="861141486022 WCAP-AI3H 35x40" type="Al electrolytic"
Cblk3 link 0 330µ V=450 Irms=1.45 Rser=0.104 Lser=24.231n mfg="W・th Elektronik" pn="861141486022 WCAP-AI3H 35x40" type="Al electrolytic"
Cblk4 link 0 330µ V=450 Irms=1.45 Rser=0.104 Lser=24.231n mfg="W・th Elektronik" pn="861141486022 WCAP-AI3H 35x40" type="Al electrolytic"
Cblk5 link 0 330µ V=450 Irms=1.45 Rser=0.104 Lser=24.231n mfg="W・th Elektronik" pn="861141486022 WCAP-AI3H 35x40" type="Al electrolytic"
X§X42 N014 N015 pwm params: tri=0 freq=140k phase=0
X§X44 IL N005 lpf params: f=70k n=1 q=0.5
X§X40 N015 N011 duty samplehold
X§X46 ve2 dff N010 sum
X§X47 N003 N004 zd dff mux
X§X48 Vac N008 N006 mul
X§X49 Vlink N008 inverse
X§X50 N002 N006 N003 sub
X§X51 N002 CONST K=1  ; pins K
X§X52 N010 N011 LIMIT max=1 min=0  ; pins in out
X§X11 link pwmlfh N iNMOS params: esl=1f rsnb=1k csnb=10p ron=10m  ; pins D G S
X§X12 N pwmlfl 0 iNMOS params: esl=1f rsnb=1k csnb=10p ron=10m  ; pins D G S
X§X53 N014 CONST K=0.01  ; pins K
R1 link swh1 30k
R2 swh1 swh2 30k
R3 swl1 0 30k
R4 swl2 swl1 30k
R5 swh2 swl2 60k
X§X43 N002 N006 N004 sum

* block symbol definitions
.subckt vac1ph n p
V1 p n SINE(0 {vamp} {freq})
.param freq=60
.param vac=100
* Single Phase AC Power
* frequency(Hz)
* ac voltage(Vrms)
.param vamp={vac*SQRT(2)}
* 2026-06-21
* <Revision History>
* 2024-12-29: Initial version
* 2026-06-21: Corrected amplitude calculation by removing the 0.5 factor.
.ends vac1ph

.subckt vmon n out p
B1 out 0 V=V(p)-V(n)
I1 p n 0
* Voltage Monitor
* positive
* negative
* 2024-12-29
.ends vmon

.subckt pwm duty pwm
R2 c 0 1k
A1 c 0 0 0 0 0 pwm 0 BUF
V1 saw 0 PULSE(0 1 {phase/(360*freq)} {IF(tri==0,1/freq-1n,1/(2*freq))} {IF(tri==0,0.5n,1/(2*freq))} {IF(tri==0,0.5n,0)} {1/freq})
.machine
.state LO 0
.state HI 1
.rule HI LO V(saw)>V(duty)
.rule LO HI V(saw)< V(duty)
.output (c) state
.endmachine
.param freq=100k
.ic V(pwm)=0
.param phase=0
* Pulse Width Modulator
* 2026-09-21
* frequency(Hz)
.param tri=0
* 0: Saw, 1; Triangular
* phase(deg)
* <Revision History>
* 2024-12-29: Initial version
* 2026-09-21: Added tri parameter to select a triangular carrier (tri=1) or retain the original sawtooth carrier (tri=0, default).
.ends pwm

.subckt deadtime in l h
A1 in 0 0 0 0 0 N002 0 BUF
A2 in 0 0 0 0 0 N001 0 BUF TD={dt}
A3 0 N001 0 N002 0 0 h 0 AND
A4 0 N001 0 N002 0 l 0 0 OR
.param dt=10n
* Deadtime Generator
* deadtime(sec)
* hi-side
* lo-side
* in
* h
* l
* dt
* dt
* 2024-12-29
.ends deadtime

.subckt zcd in zcd
R1 a 0 1k
A1 a 0 0 0 0 0 zcd 0 BUF
* Zero Cross Detector
* binary
* 1: input positive
* 0: input negative
* 2025-07-21
.machine
.state LO 0
.state HI 1
.rule LO HI V(in)>{hys}
.rule HI LO V(in)<-{hys}
.output (a) state
.endmachine
.param hys=0
* hysteresis voltage
* <Revision History>
* 2024-12-29: Initial version
* 2025-07-21: Changed to .machine and added hysteresis.
.ends zcd

.subckt gain in out
B1 out 0 V={G}*V(in)
.param G=1
* GAIN
* 2024-12-29
.ends gain

.subckt abs in out
B1 out 0 V=abs(V(in))
* Absoute Value
* 2024-12-29
.ends abs

.subckt mul in1 in2 out
B1 OUT 0 V=V(IN1)*V(IN2)
R1 IN1 0 1Meg
R2 IN2 0 1Meg
* Multiplier
.ends mul

.subckt mux in1 in2 sel out
B1 out 0 V=IF(V(sel)>0.5,V(in1),V(in2))
* 2-1 Multiplexer
* binary
* 1: out=in1
* 0: out=in2
.ends mux

.subckt type2_gm fb ref ve
B1 0 ve I=(limit(V(ref)-V(fb),{-Ilim},{Ilim}))
R1 ve N001 {Rz1}
C1 N001 0 {Cz1}
R2 ve 0 {avol}
C2 ve 0 {Co1}
D1 -V ve myD
V1 +V 0 {vh}
V2 -V 0 {vl}
D2 ve +V myD
.param g=1
.param fz1=1k
.param fp1=20k
.param vh=5
.param vl=0
.param avol=100k
* Type 2 Compensator, Gm amp base
* target gain at fz1
* zero frequency(Hz)
* pole frequency(Hz)
* max ouput voltage(V)
* min output voltage(V)
* open loop gain
* 2025-08-31
.param Rz1={(g*avol)/(avol-g)}
.param Cz1={1/(2*PI*fz1*Rz1)}
.param Co1={1/(2*PI*fp1*Rz1)}
.ic V(ve)=0
.MODEL myD D(RON=1u ROFF=1G Vfwd=10n)
.param Ilim=1000
* <Revision History>
* 2025-08-31: Initial version
* feedback
* reference
* * TYPE2_gm is a Gm-amp based version of TYPE2.
* * Unlike the op-amp based TYPE2, it offers high input impedance at ref/fb
* * and is better suited for dynamic reference applications (e.g. soft-start,
* * motor speed control). Both models are kept for flexibility.
.ends type2_gm

.subckt exor in1 in2 out
A1 0 in1 0 in2 0 0 out 0 XOR
* binary
* binary
* binary
* Exclusive OR
* 2024-12-29
.ends exor

.subckt lpf in out
R1 a N001 1k
C1 a 0 {Co}
B1 N001 0 V=V(in)
B2 v0 0 V=V(a)
B3 out 0 V=IF({n}==1,V(v0),V(v1))
R2 v1 0 1Gig
C2 v1 0 1
B5 0 v1 I=V(v2)
R3 v2 0 1Gig
C3 v2 0 1
B4 0 v2 I={-(2*pi*f)*(2*pi*f)*V(v1)-(2*pi*f/q)*V(v2)+(2*pi*f)*(2*pi*f)*V(in)}
* 1st/2nd order Low Pass Filter
* 2025-12-26
.param f=100k
.param n=1
.param q=0.5
.param Co=1/({f}*2k*PI)
* cut off frequency
* filter order (1:1st order, other: 2nd order)
* q factor (only for 2nd order)
* 1st Order LPF
* 2nd Order LPF
* <Revision History>
* 2025-03-23: Initial version
* 2025-12-26:
*  -  Replaced LTspice built in 2ndOrderLPF with discrete circuit to improve convergence.
*  -  Removed output MUX and replaced it with BV.
.ends lpf

.subckt samplehold CLK IN OUT
R1 o 0 1k
B1 OUT 0 V=V(o)
* Sample & Hold
* binary
* 2025-3-23
.machine
.state LO 0
.state LATCH 1
.state HI 2
.rule LO LATCH V(clk)>.5
.rule LATCH HI  V(clk)>.9
.rule * LO V(clk)<.5
.output (o) IF((state==1),V(in),V(out))
.endmachine
.ends samplehold

.subckt sum in1 in2 out
B1 OUT 0 V=V(IN1)+V(IN2)
* SUM
* 2024-12-29
.ends sum

.subckt inverse in out
B1 out 0 V=IF(V(in)>0,IF(V(in)>(1/{vsat}),1/V(in),{vsat}),IF(V(in)>(-1/{vsat}),-{vsat},1/V(in)))
C1 out 0 10p Rser=1k
* Inverse
* 2025-2-23
.param vsat=1k
* saturation voltage
* <Revision History>
* 2025-01-03: Initial Versoin.
* 2025-02-23: Added RC snubber(10pF-1kohm) at output to reduce spike
.ends inverse

.subckt sub in1 in2 out
B1 OUT 0 V=V(IN1)-V(IN2)
* SUBTRACT
* 2024-12-29
.ends sub

.model D D
.lib standard.dio
* Single Phase Input Four-Level Totempole PFC
* 2026-06-21
.tran 0 {10/60} {1/60}
.options solver="norm"
.options method="gear"
;.options debugtran
;.ic V(link)={120*sqrt(2)}
* 2025-11-24       Initial release
* 2026-06-21
*  - Changed to new VAC1PH and adjusted parameters.
*  - Added .options command to specify integration method.
.backanno
.end